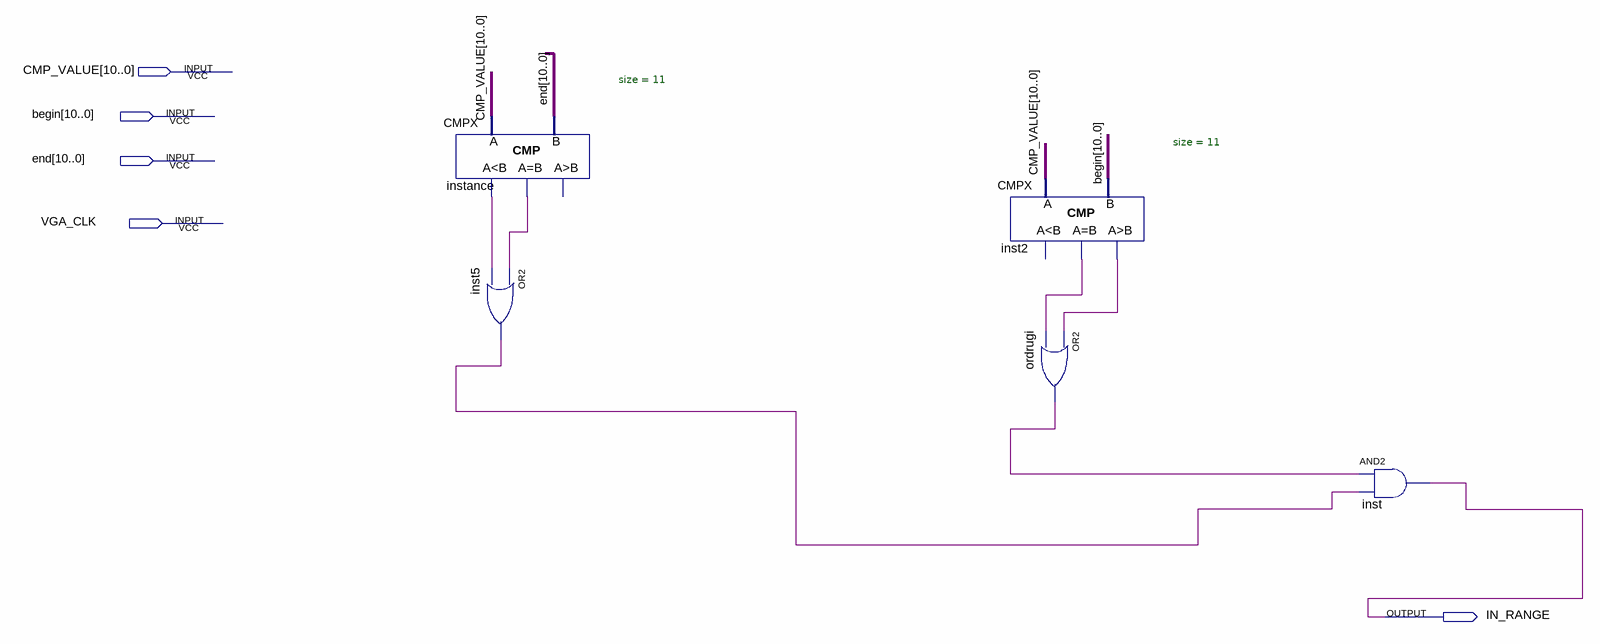
[diagram p0: schematic sheet]
// Quartus schematic inRangeCMP11.bdf as structural Verilog: 5 symbols, 5 pins
module inRangeCMP11 (
  input  [10:0] CMP_VALUE,
  input  [10:0] \begin ,
  input  [10:0] \end ,
  input  VGA_CLK,
  output IN_RANGE
);

  wire inst2_eq, inst2_gr, inst5_out, instance_eq, instance_ls, ordrugi_out;

  CMPX #(.size(11)) \instance  (.A(CMP_VALUE), .B(\end ), .ls(instance_ls), .eq(instance_eq));  // open: gr
  or inst5 (inst5_out, instance_eq, instance_ls);
  CMPX #(.size(11)) inst2 (.A(CMP_VALUE), .B(\begin ), .eq(inst2_eq), .gr(inst2_gr));  // open: ls
  or ordrugi (ordrugi_out, inst2_gr, inst2_eq);
  and inst (IN_RANGE, ordrugi_out, inst5_out);
endmodule
